# EAGLE design Main_Board (EAGLE 9.2.0)
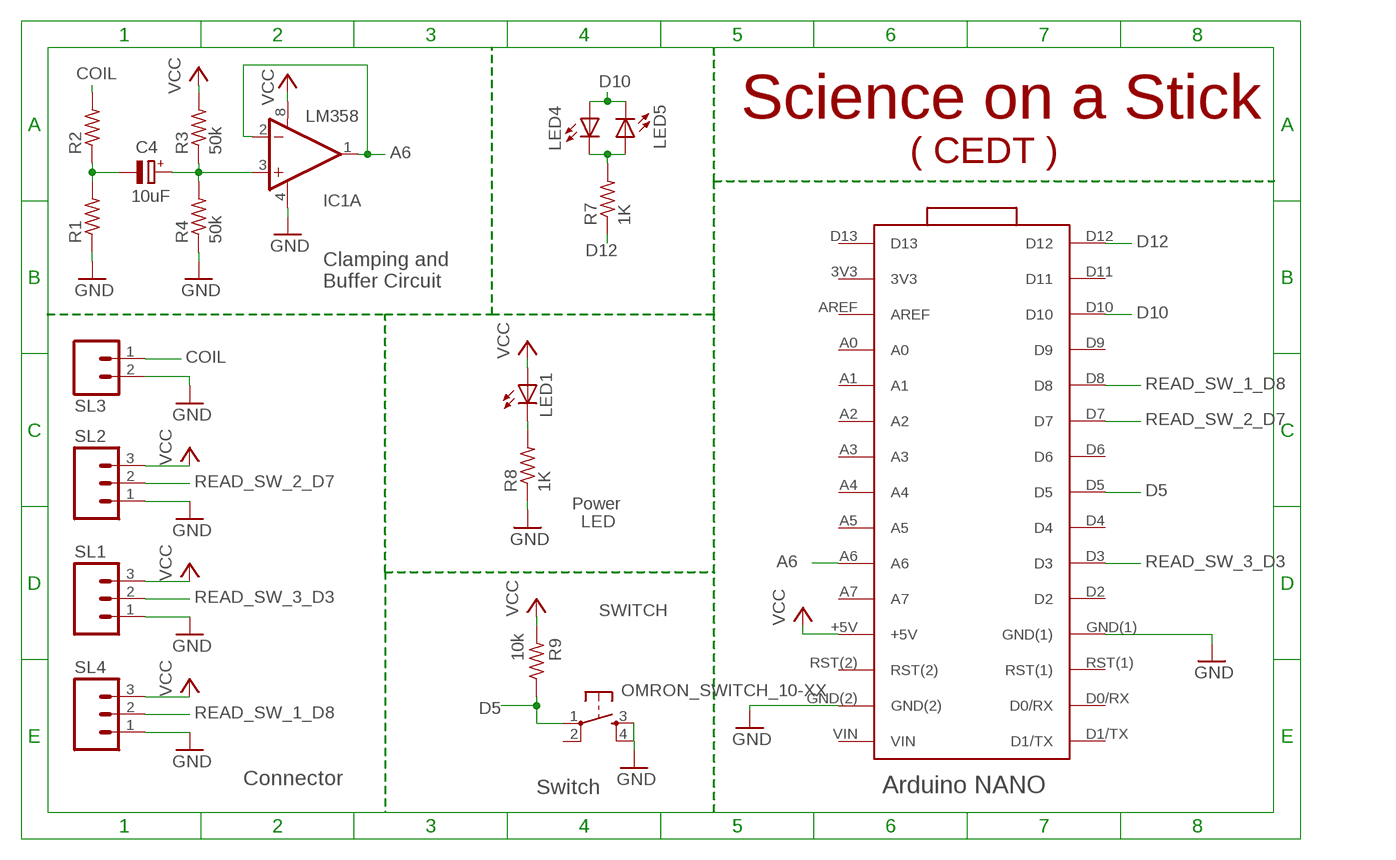
[diagram p0: schematic, sheet 1]

## Parts
C4  10uF  CPOL-EUE2.5-5  [E2,5-5]
IC1  LM358  OPAMP-DUALDIP  [DIP08]
LED1  LED3MM  [LED3MM]
LED4  LED3MM  [LED3MM]
LED5  LED3MM  [LED3MM]
R1  RESISTOR0207/7  [0207/7]
R2  RESISTOR0207/7  [0207/7]
R3  50k  RESISTOR0207/7  [0207/7]
R4  50k  RESISTOR0207/7  [0207/7]
R7  1K  RESISTOR0207/7  [0207/7]
R8  1K  RESISTOR0207/7  [0207/7]
R9  10k  RESISTOR0207/7  [0207/7]
SL1  M03  [03P]
SL2  M03  [03P]
SL3  M02  [02P]
SL4  M03  [03P]
SWITCH  OMRON_SWITCH_10-XX  [B3F-10XX]
U$1  ARDUINO_NANO_3_ARDUINO(NANO_3.0)  [ARDUINO_NANO_3_ARDUINO_NANO_30PIN]

## Nets
A6: IC1.1(A:OUT) IC1.2(A:-IN) U$1.A6
CLAMP_SIGNAL: C4.+ IC1.3(A:+IN) R3.1 R4.2
COIL: R2.2 SL3.1
D5: R9.1 SWITCH.1(P) U$1.D5
D10: LED4.A LED5.K(C) U$1.D10
D12: R7.1 U$1.D12
GND: IC1.4(A:V-) R1.1 R4.1 R8.1 SL1.1 SL2.1 SL3.2 SL4.1 SWITCH.3(S) SWITCH.4(S1) U$1.GND(1) U$1.GND(2)
N$1: C4.- R1.2 R2.1
N$6: LED1.K(C) R8.2
N$10: LED4.K(C) LED5.A R7.2
READ_SW_1_D8: SL4.2 U$1.D8
READ_SW_2_D7: SL2.2 U$1.D7
READ_SW_3_D3: SL1.2 U$1.D3
VCC: IC1.8(A:V+) LED1.A R3.2 R9.2 SL1.3 SL2.3 SL4.3 U$1.+5V
Unconnected: IC1.5(B:+IN) IC1.6(B:-IN) IC1.7(B:OUT) SWITCH.2(P1) U$1.3V3 U$1.A0 U$1.A1 U$1.A2 U$1.A3 U$1.A4 U$1.A5 U$1.A7 U$1.AREF U$1.D0/RX U$1.D1/TX U$1.D2 U$1.D4 U$1.D6 U$1.D9 U$1.D11 U$1.D13 U$1.RST(1) U$1.RST(2) U$1.VIN

## Notes on the sheet
- Science on a Stick
- ( CEDT )
- Clamping and 
  Buffer Circuit
- Power
- LED
- Arduino NANO
- Connector
- Switch

## Library data of the parts
C4 = MSP-MB_V12:CPOL-EU: POLARIZED CAPACITOR, European symbol
IC1 = SparkFun-AnalogIC:OPAMP-DUAL: Generic op-amp footprint
LED1 LED4 LED5 = CEDT_JANUARY_2015_v5:LED
R1-R4 = Arduino_Hackathon_v5:RESISTOR
R7-R9 = CEDT_JANUARY_2015_v5:RESISTOR
SL1 SL2 SL4 = msp framework:M03: AMP QUICK CONNECTOR
SL3 = CEDT_JANUARY_2015_v5:M02: AMP QUICK CONNECTOR
SWITCH = CEDT_JANUARY_2015_v5:OMRON_SWITCH
U$1 = 1 D hour glass_V1:ARDUINO_NANO_3_ARDUINO(NANO_3.0)

## Board
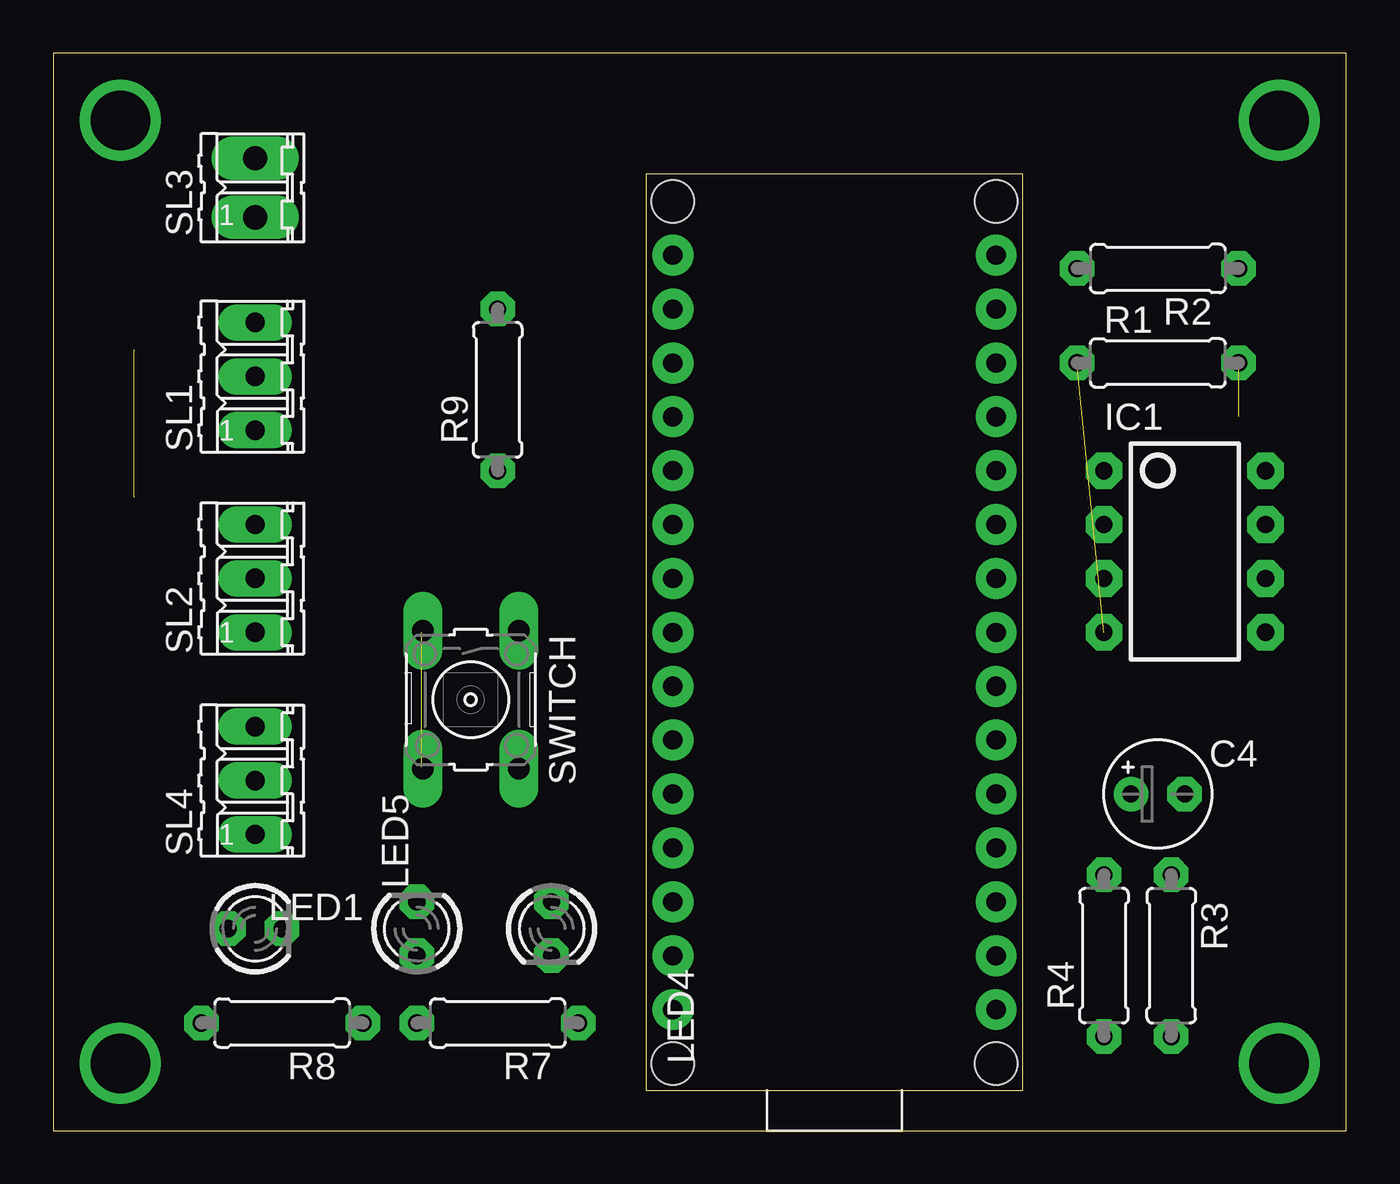
[diagram p1: board, top side]
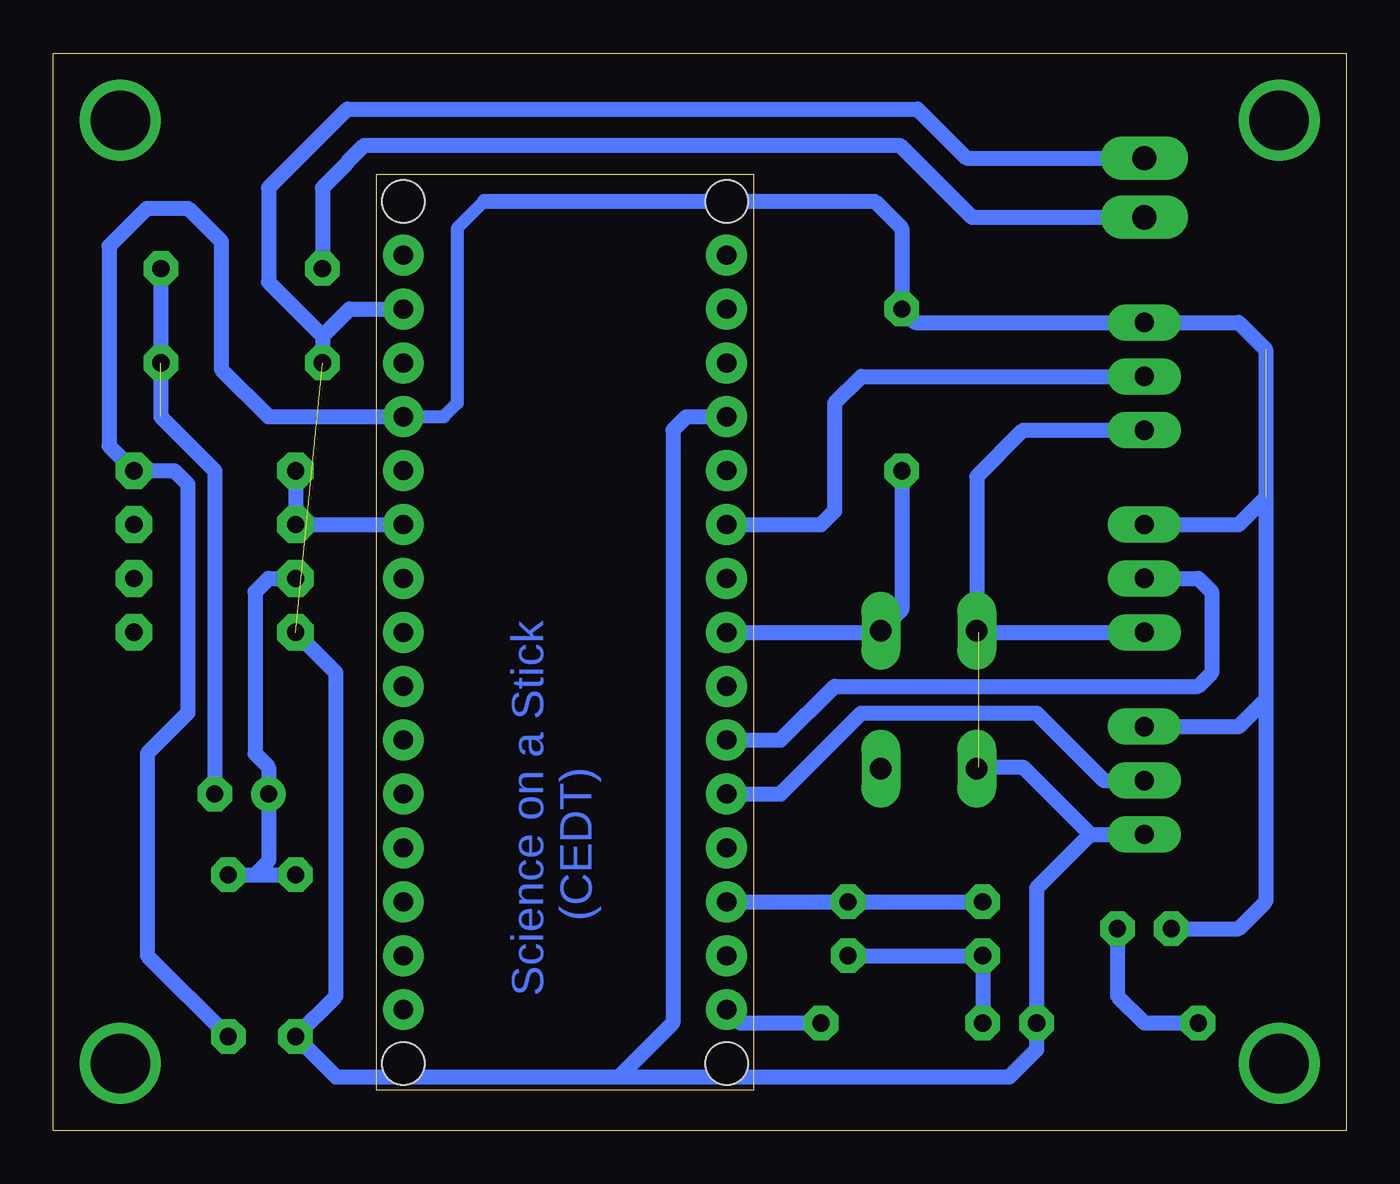
[diagram p2: board, bottom side, seen from below]

Size 60.96 x 50.8 mm. Coordinates in mm from the lower left corner, seen from the top.
Outline: 0,0 60.96,0 60.96,50.8 0,50.8 0,0
Copper layers (1*16): Top 0.035mm / dielectric 1.5mm / Bottom 0.035mm
Design rules "default *": minimum track width 10mil, minimum drill 24mil, track to track 16mil, track to pad 16mil, pad to pad 16mil, via to via 16mil, smd to smd 16mil, copper to edge 40mil, drill to drill 8mil, minimum pad ring 16mil, minimum via ring 16mil, stop-mask expansion 4mil, vias tented up to drill 0mil, thermal gap 10mil

### Footprints (pad centres in the part's own frame; a part is rotated, then mirrored left to right if it is on the bottom)
E2,5-5 = drill 0.813 pad 1.6: + -1.27,0 | drill 0.813 pad 1.6 octagon: - 1.27,0
DIP08 = drill 0.813 pad 1.727 octagon: 1 -3.81,-3.81; 2 -1.27,-3.81; 3 1.27,-3.81; 4 3.81,-3.81; 5 3.81,3.81; 6 1.27,3.81; 7 -1.27,3.81; 8 -3.81,3.81
LED3MM = drill 0.813 octagon: A -1.27,0; K 1.27,0
0207/7 = drill 0.813 octagon: 1 -3.81,0; 2 3.81,0
03P = drill 0.914 long: 1 -2.54,0; 2 0,0; 3 2.54,0
02P = drill 1.143 long: 1 -1.397,0; 2 1.397,0
B3F-10XX = drill 1.016 long: 1 -3.251,2.261; 2 3.251,2.261; 3 -3.251,-2.261; 4 3.251,-2.261
ARDUINO_NANO_3_ARDUINO_NANO_30PIN = drill 0.9 pad 1.93: 3V3 16.51,6.35; +5V 16.51,31.75; A0 16.51,11.43; A1 16.51,13.97; A2 16.51,16.51; A3 16.51,19.05; A4 16.51,21.59; A5 16.51,24.13; A6 16.51,26.67; A7 16.51,29.21; AREF 16.51,8.89; D0/RX 1.27,36.83; D1/TX 1.27,39.37; D2 1.27,29.21; D3 1.27,26.67; D4 1.27,24.13; D5 1.27,21.59; D6 1.27,19.05; D7 1.27,16.51; D8 1.27,13.97; D9 1.27,11.43; D10 1.27,8.89; D11 1.27,6.35; D12 1.27,3.81; D13 16.51,3.81; GND(1) 1.27,31.75; GND(2) 16.51,36.83; RST(1) 1.27,34.29; RST(2) 16.51,34.29; VIN 16.51,39.37 | hole 2: 1.27,41.91; 16.51,41.91; 16.51,1.27; 1.27,1.27

### Placement (x,y rotation side)
C4  52.07,15.88 0 top
IC1  53.34,27.3 270 top
LED1  9.53,9.53 0 top
LED4  23.5,9.53 270 top
LED5  17.14,9.53 90 top
R1  52.07,36.2 0 top
R2  52.07,40.64 180 top
R3  52.7,8.26 270 top
R4  49.53,8.26 90 top
R7  20.95,5.08 180 top
R8  10.79,5.08 180 top
R9  20.95,34.92 90 top
SL1  9.53,35.56 90 top
SL2  9.53,26.04 90 top
SL3  9.53,44.45 90 top
SL4  9.53,16.51 90 top
SWITCH  19.68,20.32 270 top
U$1  27.94,1.91 0 top

### Tracks (layer width: path | path; a pad name or v marks a point on that pad's centre or on a via)
A6
  Bottom 0.711: IC1.1 IC1.2 U$1.A6
CLAMP_SIGNAL
  Bottom 0.711: IC1.3 50.8,26.04 51.44,25.4 51.44,17.78 50.8,17.14 C4.+ 50.8,12.7 51.44,12.06 | 51.44,12.06 R4.2 | R3.1 51.44,12.06
COIL
  Bottom 0.711: SL3.1 17.65,43.05 21.06,46.46 46.29,46.46 47.09,45.65 47.09,45.62 48.26,44.45 R2.2
D5
  Bottom 0.711: R9.1 20.95,24.56 SWITCH.1 22.02,23.5 U$1.D5
D10
  Bottom 0.711: LED5.K LED4.A U$1.D10
D12
  Bottom 0.711: U$1.D12 28.57,5.08 R7.1
GND  (2 unrouted)
  Bottom 0.711: U$1.GND(1) 31.11,33.66 31.75,33.02 31.75,5.08 34.29,2.54 | 34.29,2.54 47.62,2.54 R4.1 47.62,6.35 47.62,21.59 IC1.4 | SL2.1 17.35,23.5 SWITCH.3 | 17.42,23.85 SWITCH.3 | SWITCH.3 17.42,30.84 15.24,33.02 SL1.1 | SWITCH.4 17.35,17.14 15.24,17.14 12.06,13.97 | 48.26,37.47 46.99,38.73 U$1.GND(2) | 48.26,37.47 R1.1 | 12.06,13.97 SL4.1 | SL3.2 17.91,45.85 20.22,48.16 47.09,48.16 50.8,44.45 50.8,40.01 48.26,37.47 | 34.29,2.54 15.88,2.54 14.61,3.81 R8.1 14.61,11.43 12.06,13.97
N$1  (1 unrouted)
  Bottom 0.711: C4.- 53.34,31.11 55.88,33.66 R2.1
N$2  (via drill 2.8)
  other vias: 3.17,47.62
N$3  (via drill 2.8)
  other vias: 57.78,47.62
N$4  (via drill 2.8)
  other vias: 3.17,3.17
N$6
  Bottom 0.711: R8.2 9.53,5.08 10.79,6.35 LED1.K
N$7  (via drill 2.8)
  other vias: 57.78,3.17
N$10
  Bottom 0.711: LED4.K LED5.A R7.2
READ_SW_1_D8
  Bottom 0.711: U$1.D8 26.67,15.88 22.86,19.68 14.61,19.68 11.43,16.51 SL4.2 8.89,16.51
READ_SW_2_D7
  Bottom 0.711: SL2.2 6.99,26.04 6.35,25.4 6.35,21.59 6.99,20.95 24.13,20.95 26.67,18.41 U$1.D7
READ_SW_3_D3
  Bottom 0.711: U$1.D3 24.77,28.57 24.13,29.21 24.13,34.29 22.86,35.56 SL1.2
VCC  (1 unrouted)
  Bottom 0.61: U$1.+5V 42.55,33.66 41.91,34.29 41.91,42.55 40.64,43.81
  Bottom 0.711: U$1.+5V 50.8,33.66 53.03,35.89 53.03,41.93 54.59,43.48 56.53,43.48 58.32,41.7 58.32,32.28 IC1.8 55.24,31.11 54.61,30.48 54.61,19.68 56.52,17.78 56.52,8.26 R3.2 | 10.16,19.05 SL4.3 5.08,19.05 3.81,20.32 | SL2.3 5.08,28.57 3.81,29.84 | 40.64,43.81 22.23,43.81 20.95,42.55 R9.2 20.32,38.1 SL1.3 5.08,38.1 3.81,36.83 3.81,20.32 | LED1.A 5.08,9.53 3.81,10.79 3.81,20.32

### Text on the board
Bottom: Science on a Stick / (CEDT)